# Altium schematic sheet HIP4082driver.SchDoc
size A4
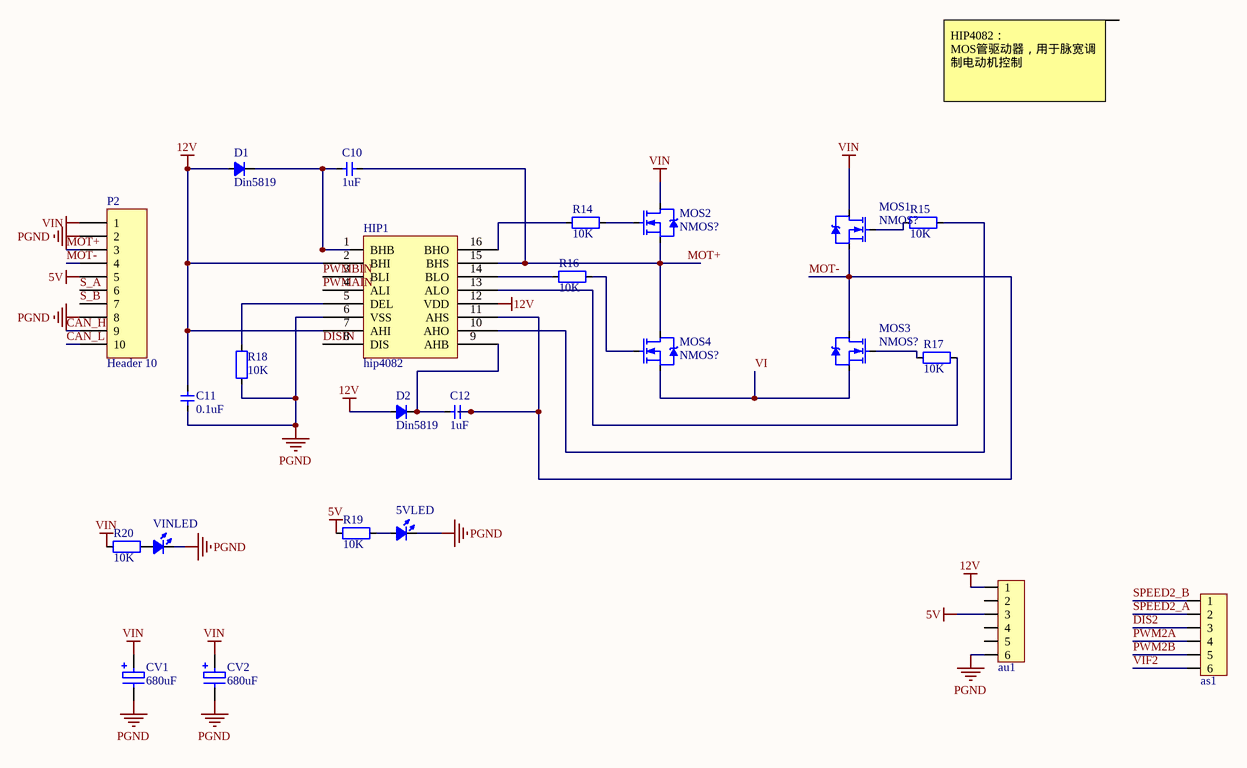
[diagram p0: HIP4082driver.SchDoc]

## Parts
5VLED  LED_0805  [LED_0805_BLUE]  (value not drawn)
as1  HDR1x6_2.54  [HDR1X6_2.54_180]  (value not drawn)
au1  HDR1x6_2.54  [HDR1X6_2.54_180]  (value not drawn)
C10  value 1uF  [CAP_0603]  (hidden comment: Cap_0603)
C11  value 0.1uF  [CAP_0603]  (hidden comment: Cap_0603)
C12  value 1uF  [CAP_0603]  (hidden comment: Cap_0603)
CV1  680uF  [CAP_ELE_680UF0.7X5MM]
CV2  680uF  [CAP_ELE_680UF0.7X5MM]
D1  Din5819  [SOD-323]
D2  Din5819  [SOD-323]
HIP1  hip4082  [SOP_E150_16]
MOS1  value NMOS?  [TO-252AA]  (hidden comment: MOSFET_N)
MOS2  value NMOS?  [TO-252AA]  (hidden comment: MOSFET_N)
MOS3  value NMOS?  [TO-252AA]  (hidden comment: MOSFET_N)
MOS4  value NMOS?  [TO-252AA]  (hidden comment: MOSFET_N)
P2  Header 10  [Green_10P]
R14  value 10K  [RES_0603]  (hidden comment: Res_0603)
R15  value 10K  [RES_0603]  (hidden comment: Res_0603)
R16  value 10K  [RES_0603]  (hidden comment: Res_0603)
R17  value 10K  [RES_0603]  (hidden comment: Res_0603)
R18  value 10K  [RES_0603]  (hidden comment: Res_0603)
R19  value 10K  [RES_0603]  (hidden comment: Res_0603)
R20  value 10K  [RES_0603]  (hidden comment: Res_0603)
VINLED  LED_0805  [LED_0805_RED]  (value not drawn)

## Nets
5V: au1.3 P2.5 R19.1
12V: au1.1 C11.2 D1.1(A) D2.1(A) HIP1.2(BHI) HIP1.7(AHI) HIP1.12(VDD)
PGND: 5VLED.2(K) au1.6 C11.1 CV1.2 CV2.2 HIP1.6(VSS) P2.2 P2.8 R18.1 VINLED.2(K)
VIN: CV1.1 CV2.1 MOS1.4(D) MOS2.4(D) P2.1 R20.1
CAN_H: P2.9
CAN_L: P2.10
DIS2: as1.3
DISIN: HIP1.8(DIS)
MOT+: C10.2 HIP1.15(BHS) MOS2.3(S) MOS4.4(D) P2.3
MOT-: C12.2 HIP1.11(AHS) MOS1.3(S) MOS3.4(D) P2.4
PWM2A: as1.4
PWM2B: as1.5
PWMAIN: HIP1.4(ALI)
PWMBIN: HIP1.3(BLI)
S_A: P2.6
S_B: P2.7
SPEED2_A: as1.2
SPEED2_B: as1.1
VI: MOS3.3(S) MOS4.3(S)
VIF2: as1.6
Net5VLED_1: 5VLED.1(A) R19.2
NetC10_1: C10.1 D1.2(K) HIP1.1(BHB)
NetC12_1: C12.1 D2.2(K) HIP1.9(AHB)
NetHIP1_5: HIP1.5(DEL) R18.2
NetHIP1_10: HIP1.10(AHO) R15.2
NetHIP1_13: HIP1.13(ALO) R17.2
NetHIP1_14: HIP1.14(BLO) R16.1
NetHIP1_16: HIP1.16(BHO) R14.1
NetMOS1_1: MOS1.1(G) R15.1
NetMOS2_1: MOS2.1(G) R14.2
NetMOS3_1: MOS3.1(G) R17.1
NetMOS4_1: MOS4.1(G) R16.2
NetR20_2: R20.2 VINLED.1(A)

Not connected (* = marked no-connect by the designer): au1 2 4 5

## Notes on the sheet
- HIP4082：
  MOS管驱动器，用于脉宽调制电动机控制

## Library data of the parts
5VLED VINLED = LED_0603: LED
as1 au1 = HDR1x6_2.54: Header
C10-C12 = Cap_0603: Capacitor
CV1 CV2 = CAP-ELE: 电解电容; Value: *μF; Published: 8-Jun-2000; LatestRevisionDate: 17-Jul-2002; LatestRevisionNote: Re-released for DXP Platform.; PackageReference: RB7.6-15; Publisher: Altium Limited; PackageDescription: Polarized Capacitor (Radial); 2 Leads
D1 D2 = Diode
MOS1-MOS4 = MOSFET_N: MOSFET
P2 = Header 10: Header, 10-Pin; LatestRevisionDate: 17-Jul-2002; LatestRevisionNote: Re-released for DXP Platform.; Publisher: Altium Limited
R14-R20 = Res_0603: Resistor